# EasyEDA Pro project DreamFly.eprj, schematic Schematic4
Board Name: Board4; Create Date: 2024-12-13; Page Name: DreamFly-DataTransfer; Project Name: DreamFly; Schematic Name: Schematic4; Update Date: 2025-02-11; Company: 嘉立创EDA; Drawed: 梅雨; Page Size: A4; Version: V1.0
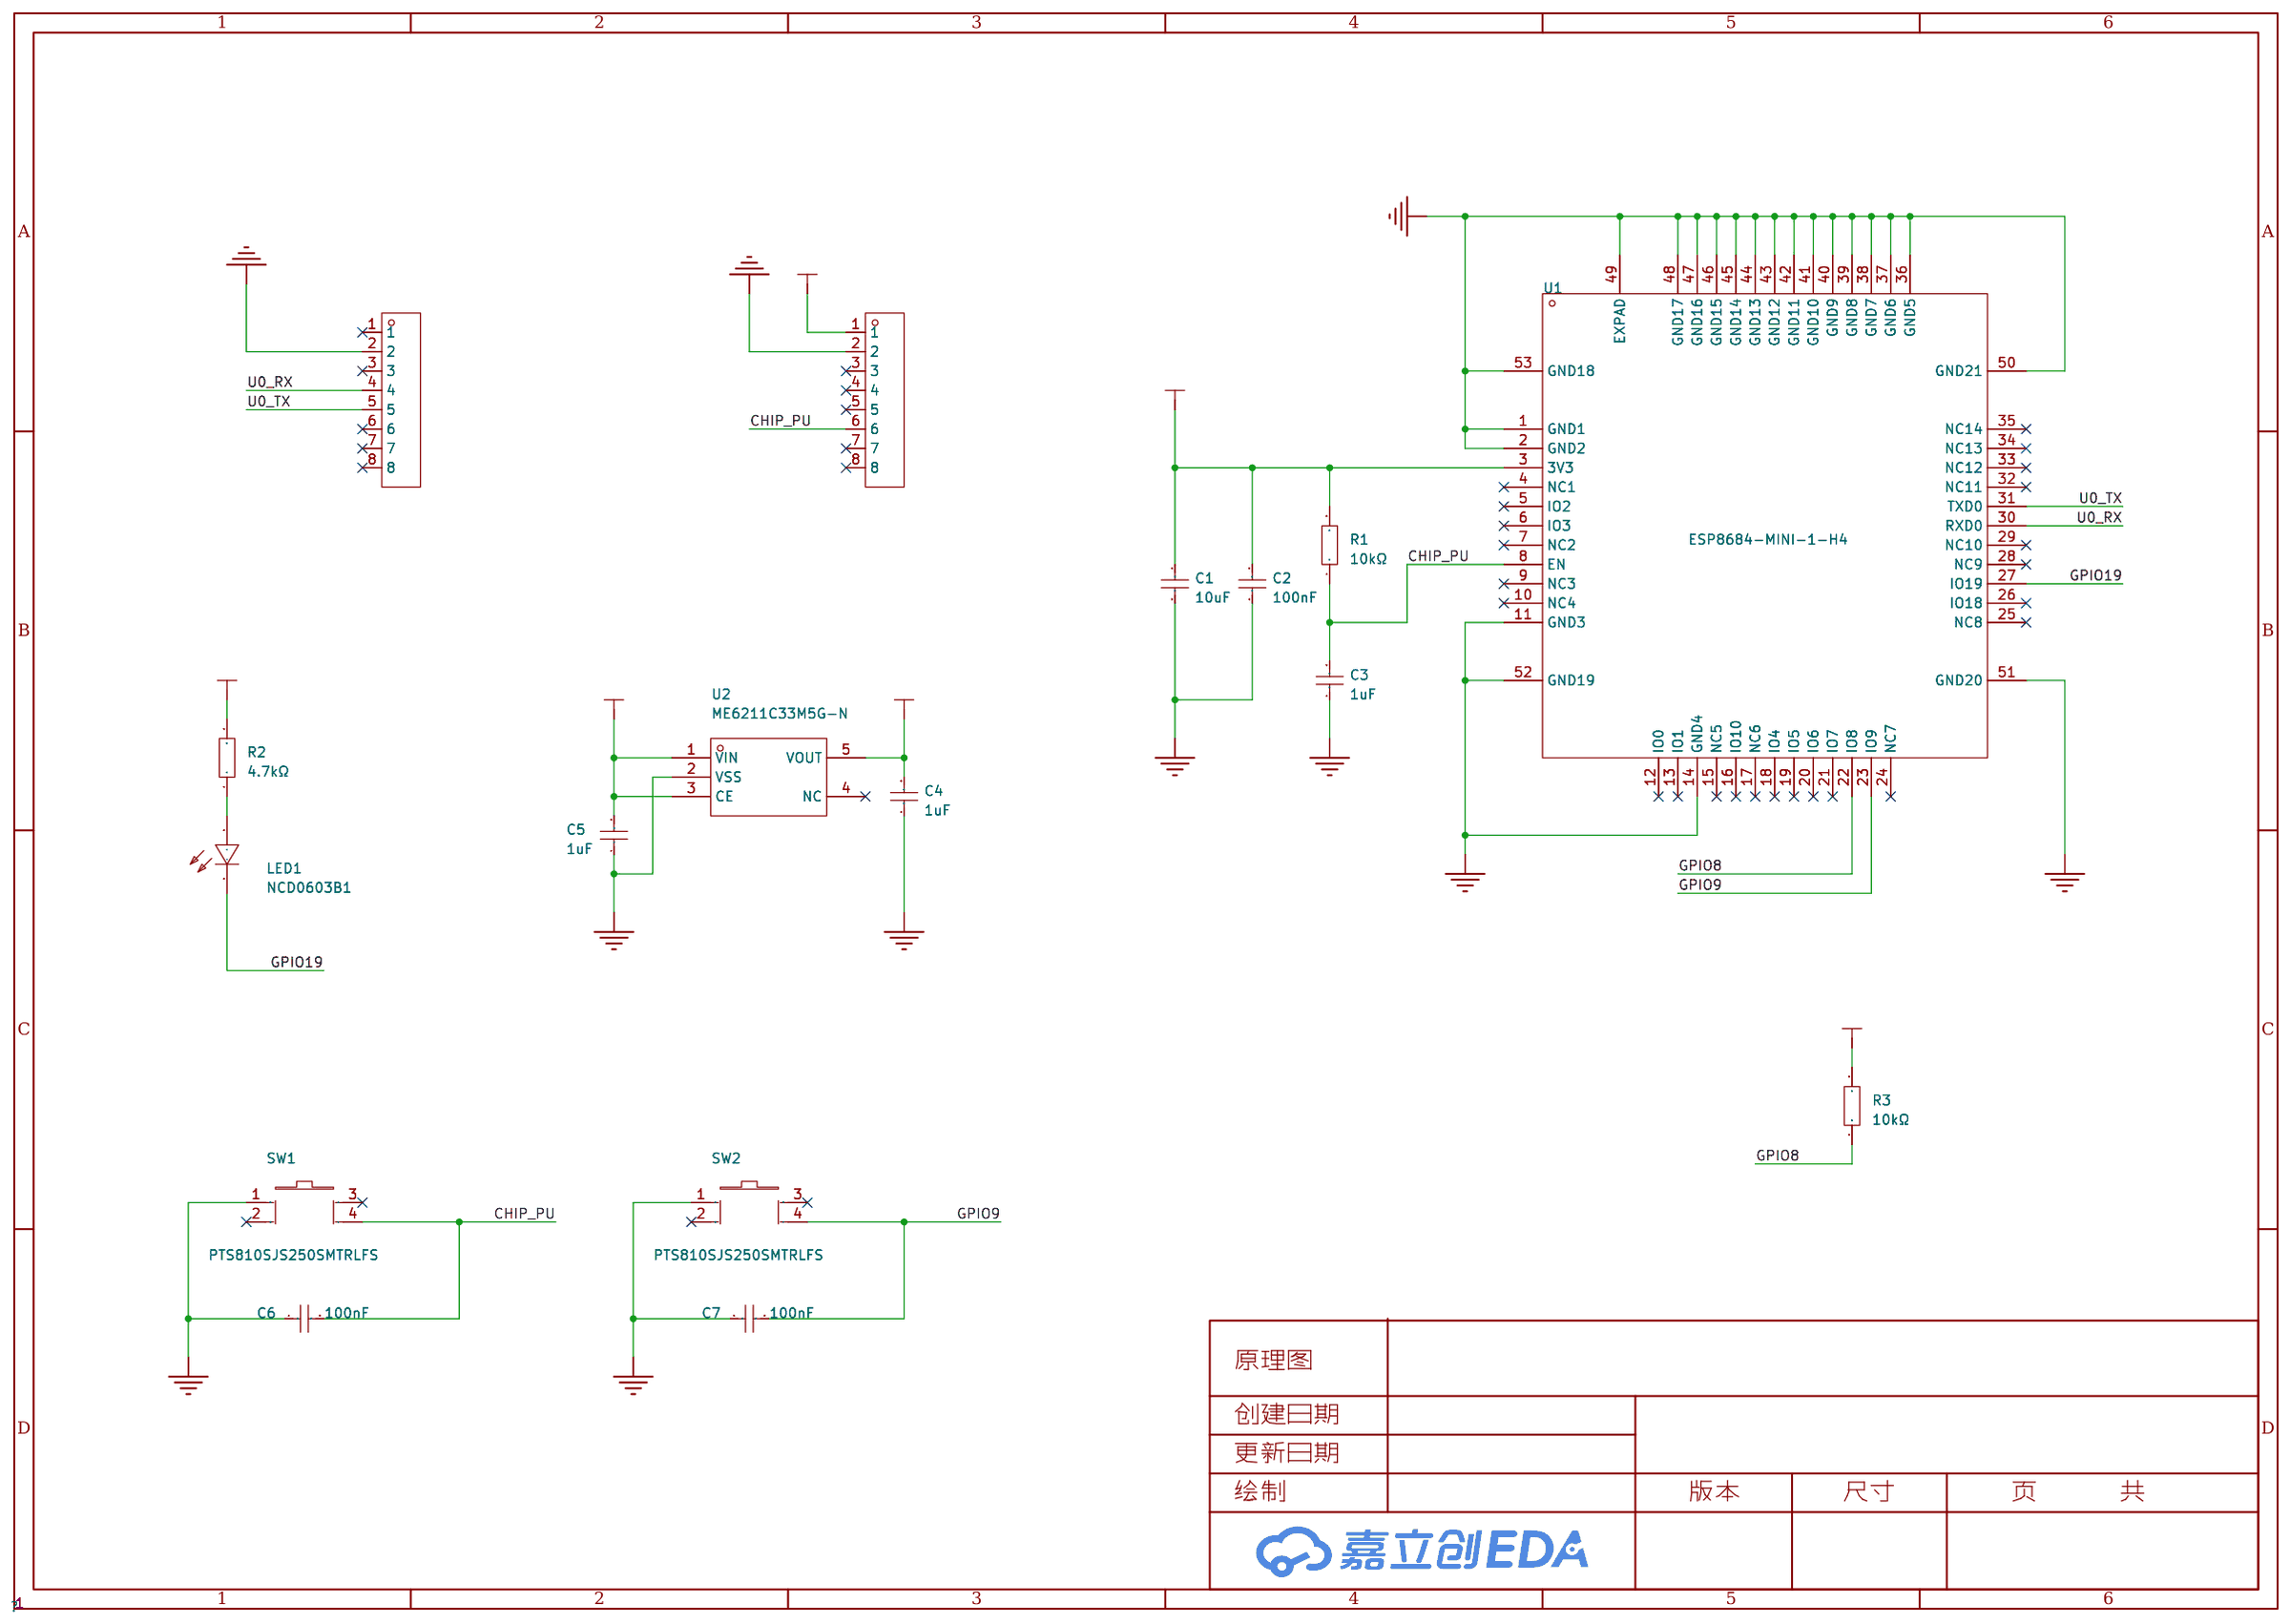
[diagram p3: schematic sheet]

## Parts
C1  10uF  [C0603]
C2  100nF  [C0603]
C3  1uF  [C0603]
C4  1uF  [C0603]
C5  1uF  [C0603]
C6  100nF  [C0603]
C7  100nF  [C0603]
LED1  NCD0603B1  [LED0603-RD]
P1  -  [header10-2.0mm]
P2  -  [header10-2.0mm]
R1  10kΩ  [R0603]
R2  4.7kΩ  [R0603]
R3  10kΩ  [R0603]
SW1  PTS810SJS250SMTRLFS  [SW-SMD_4P_PTS810SJM250SMTRLFS]
SW2  PTS810SJS250SMTRLFS  [SW-SMD_4P_PTS810SJM250SMTRLFS]
U1  ESP8684-MINI-1-H4  [WIFI-SMD_ESP8684-MINI-1]
U2  ME6211C33M5G-N  [SOT-23-5_L3.0-W1.7-P0.95-LS2.8-BL]

## Library data of the parts
C1 C2 C6 C7 = CL10A105KB8NNNC: 容值:1uF;精度:±10%;额定电压:50V;材质(温度系数):X5R;; LCSC Part Name: 1uF ±10% 50V; Supplier Part: C15849; Manufacturer: SAMSUNG(三星); Supplier Footprint: 0603; JLCPCB Part Class: Basic Part; Datasheet: https://atta.szlcsc.com/upload/public/pdf/source/20160218/1457707763339.pdf; Supplier: LCSC; Tolerance: ±10%; Voltage Rated: 50V; Temperature Coefficient: X5R
C3-C5 = CL10B104KB8NNNC: 容值:100nF;精度:±10%;额定电压:50V;材质(温度系数):X7R;; LCSC Part Name: 100nF ±10% 50V; Supplier Part: C1591; Manufacturer: SAMSUNG(三星); Supplier Footprint: 0603; JLCPCB Part Class: Extended Part; Datasheet: https://atta.szlcsc.com/upload/public/pdf/source/20160218/1457707763339.pdf; Supplier: LCSC; Tolerance: ±10%; Voltage Rated: 50V; Temperature Coefficient: X7R
LED1 = NCD0603B1: 发光颜色:蓝色;正向电压(VF):2.6V~3.6V;功率:72mW;正向电流:10mA;主波长:463nm~475nm;透镜颜色:无色透明透镜;发光强度:80mcd~220mcd;发光角度:130°;工作温度:-30℃~+85℃;; Supplier Part: C84266; Manufacturer: 国星光电; Supplier Footprint: 0603; JLCPCB Part Class: 扩展库; Datasheet: https://atta.szlcsc.com/upload/public/pdf/source/20200820/C84266_6A3CDBEFA72C6CAD68EDA53474ADAE6C.pdf; Supplier: LCSC; Emitted Color: 蓝色; Forward Voltage (VF): 2.6V~3.6V; Power Dissipation: 72mW; Forward Current: 10mA; Dominant Wavelength: 463nm~475nm; Lens Color: 无色透明透镜; Luminous Intensity: 80mcd~220mcd; Viewing Angle: 130°; Operating Temperature: -30℃~+85℃
P1 P2 = PM200V-11-08-H43: 插孔结构:1x8P;间距:2mm;行距:-;圆孔/方孔:方孔;安装类型:直插;排数:单排;总孔位数:8P;额定电流:2A;额定电压:-;插孔方向:顶部;塑高:4.3mm;工作温度范围:-40℃~+105℃;; LCSC Part Name: 间距:2mm 1x8P 直插; Supplier Footprint: 插件,P=2mm; JLCPCB Part Class: 扩展库; Datasheet: https://atta.szlcsc.com/upload/public/pdf/source/20201127/C962324_279235CD91B6BC5DCAC73F646CF096CF.pdf; Holes Structure: 1x8P; Pitch: 2mm; Circular Hole / Square Hole: 方孔; Mounting Type: 直插; Number of Rows: 单排; Number of Holes: 8P; Current Rating (Max): 2A; Holes Direction: 顶部; Insulation Height: 4.3mm; Operating Temperature Range: -40℃~+105℃
R1 R3 = 0603WAF1002T5E: 电阻类型:厚膜电阻;阻值:10kΩ;精度:±1%;功率:100mW;最大工作电压:75V;温度系数:±100ppm/℃;; LCSC Part Name: 厚膜电阻 10kΩ ±1% 100mW; Supplier Part: C25804; Manufacturer: UNI-ROYAL(厚声); Supplier Footprint: 0603; JLCPCB Part Class: Basic Part; Datasheet: https://atta.szlcsc.com/upload/public/pdf/source/20200306/C422600_1E6D84923E4A46A82E41ADD87F860B5C.pdf; Supplier: LCSC; Type: 厚膜电阻; Tolerance: ±1%; Power(Watts): 100mW; Overload Voltage (Max): 75V; Temperature Coefficient: ±100ppm/℃; Operating Temperature Range: -55℃~+155℃
R2 = 0603WAF4701T5E: 电阻类型:厚膜电阻;阻值:4.7kΩ;精度:±1%;功率:100mW;最大工作电压:75V;温度系数:±100ppm/℃;; LCSC Part Name: 4.7kΩ ±1% 100mW 厚膜电阻; Supplier Part: C23162; Manufacturer: UNI-ROYAL(厚声); Supplier Footprint: 0603; JLCPCB Part Class: Basic Part; Datasheet: https://atta.szlcsc.com/upload/public/pdf/source/20200306/C422600_1E6D84923E4A46A82E41ADD87F860B5C.pdf; Supplier: LCSC; Type: 厚膜电阻; Tolerance: ±1%; Power(Watts): 100mW; Overload Voltage (Max): 75V; Temperature Coefficient: ±100ppm/℃; Operating Temperature Range: -55℃~+155℃
SW1 SW2 = PTS810SJS250SMTRLFS: LCSC Part Name: 轻触开关4.2mm*3.2mm，600gf; Supplier Part: C221897; Manufacturer: C&K; Supplier Footprint: SMD-4P,3.2x4.2mm; JLCPCB Part Class: 扩展库; Datasheet: https://atta.szlcsc.com/upload/public/pdf/source/20180613/C221897_9316320DEFA4333FA0E6C5D565B0D5EA.pdf; Supplier: LCSC; Circuit: 单刀单掷; Actuator Style: 圆形按钮; Operating Force: 600gf; Mounting Style: 立贴; Switch Length: 4.2mm; Switch Width: 3.2mm; Switch Height: 2.5mm; Contact Current: 50mA; Voltage Rating (DC): 16V; Pin Style: J型引脚; Operating Temperature: -40℃~+85℃
U1 = ESP8684-MINI-1-H4: LCSC Part Name: ESP8684-MINI-1-H4 非能源类; Supplier Part: C3013916; Manufacturer: ESPRESSIF(乐鑫); Supplier Footprint: SMD; JLCPCB Part Class: 扩展库; Datasheet: https://atta.szlcsc.com/upload/public/pdf/source/20230606/5690CF7B6D660FC5B5D576A4FC52E74E.pdf; Supplier: LCSC
U2 = ME6211C33M5G-N: 输出类型:固定;最大输入电压:6V;输出电压:3.3V;最大输出电流:500mA;电源纹波抑制比(PSRR):70dB;输出极性:正极;; LCSC Part Name: 输入6V 输出3.3V 500mA; Supplier Part: C82942; Manufacturer: MICRONE(南京微盟); Supplier Footprint: SOT-23-5; JLCPCB Part Class: 扩展库; Datasheet: https://atta.szlcsc.com/upload/public/pdf/source/20170918/C82942_1505727073070976520.pdf; Supplier: LCSC; Output Type: 固定; Maximum Input Voltage: 6V; Output Voltage: 3.3V; MAX Output Current: 500mA; Power Supply Rejection Ratio (PSRR): 70dB; Dropout Voltage: 260mV@(200mA); Output Polarity: 正极; Number of Outputs: 1

## Nets
3V3: C1.1 C2.1 C4.2 R1.2 R2.2 R3.2 U1.3(3V3) U2.5(VOUT)
5V: C5.2 P2.1 U2.1(VIN) U2.3(CE)
GND: C1.2 C2.2 C3.1 C4.1 C5.1 C6.1 C7.1 P1.2 P2.2 SW1.1 SW2.1 U1.1(GND1) U1.2(GND2) U1.11(GND3) U1.14(GND4) U1.36(GND5) U1.37(GND6) U1.38(GND7) U1.39(GND8) U1.40(GND9) U1.41(GND10) U1.42(GND11) U1.43(GND12) U1.44(GND13) U1.45(GND14) U1.46(GND15) U1.47(GND16) U1.48(GND17) U1.49(EXPAD) U1.50(GND21) U1.51(GND20) U1.52(GND19) U1.53(GND18) U2.2(VSS)
CHIP_PU: C3.2 C6.2 P2.6 R1.1 SW1.4 U1.8(EN)
GPIO8: R3.1 U1.22(IO8)
GPIO9: C7.2 SW2.4 U1.23(IO9)
GPIO19: LED1.1(-) U1.27(IO19)
U0_RX: P1.4 U1.30(RXD0)
U0_TX: P1.5 U1.31(TXD0)
$1N6267: LED1.2(+) R2.1

Not connected (* = marked no-connect by the designer): P1 1* 3* 6* 7* 8*; P2 3* 4* 5* 7* 8*; SW1 2* 3*; SW2 2* 3*; U1 4(NC1)* 5(IO2)* 6(IO3)* 7(NC2)* 9(NC3)* 10(NC4)* 12(IO0)* 13(IO1)* 15(NC5)* 16(IO10)* 17(NC6)* 18(IO4)* 19(IO5)* 20(IO6)* 21(IO7)* 24(NC7)* 25(NC8)* 26(IO18)* 28(NC9)* 29(NC10)* 32(NC11)* 33(NC12)* 34(NC13)* 35(NC14)*; U2 4(NC)*
